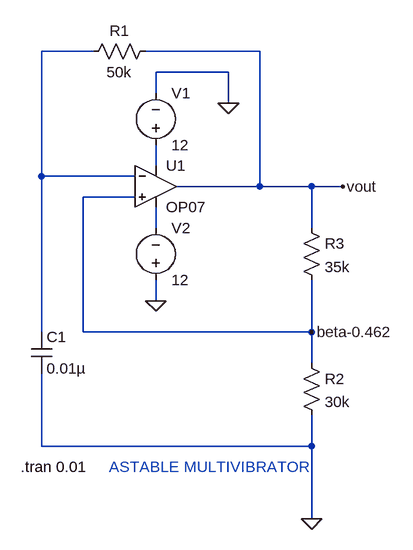
[diagram p0: schematic Astable Multivibrator.asc]
Astable Multivibrator.asc, the LTspice schematic file:
Version 4
SHEET 1 880 728
WIRE 80 -64 0 -64
WIRE 336 -64 160 -64
WIRE 288 -32 176 -32
WIRE 176 0 176 -32
WIRE 288 16 288 -32
WIRE 176 112 176 80
WIRE 0 128 0 -64
WIRE 144 128 0 128
WIRE 336 144 336 -64
WIRE 336 144 208 144
WIRE 416 144 336 144
WIRE 464 144 416 144
WIRE 144 160 64 160
WIRE 176 208 176 176
WIRE 416 208 416 144
WIRE 176 320 176 288
WIRE 0 368 0 128
WIRE 64 368 64 160
WIRE 416 368 416 288
WIRE 416 368 64 368
WIRE 416 416 416 368
WIRE 0 544 0 432
WIRE 416 544 416 496
WIRE 416 544 0 544
WIRE 416 656 416 544
FLAG 176 320 0
FLAG 288 16 0
FLAG 416 656 0
FLAG 464 144 vout
FLAG 416 368 beta-0.462
SYMBOL OpAmps\\OP07 176 80 R0
SYMATTR InstName U1
SYMBOL voltage 176 96 M180
WINDOW 0 24 96 Left 2
WINDOW 3 24 16 Left 2
WINDOW 123 0 0 Left 0
WINDOW 39 0 0 Left 0
SYMATTR InstName V1
SYMATTR Value 12
SYMBOL voltage 176 304 M180
WINDOW 0 24 96 Left 2
WINDOW 3 24 16 Left 2
WINDOW 123 0 0 Left 0
WINDOW 39 0 0 Left 0
SYMATTR InstName V2
SYMATTR Value 12
SYMBOL res 176 -80 R90
WINDOW 0 0 56 VBottom 2
WINDOW 3 32 56 VTop 2
SYMATTR InstName R1
SYMATTR Value 50k
SYMBOL cap -16 368 R0
SYMATTR InstName C1
SYMATTR Value 0.01µ
SYMBOL res 400 400 R0
SYMATTR InstName R2
SYMATTR Value 30k
SYMBOL res 400 192 R0
SYMATTR InstName R3
SYMATTR Value 35k
TEXT -32 576 Left 2 !.tran 0.01
TEXT 104 576 Left 2 ;ASTABLE MULTIVIBRATOR

The netlist it stands for:
* Astable Multivibrator.asc
XU1 beta-0.462 N001 N002 N003 vout LT1001  ; OP07, pins In+ In- V+ V- OUT
V1 N002 0 12
V2 0 N003 12
R1 vout N001 50k
C1 N001 0 0.01µ
R2 beta-0.462 0 30k
R3 vout beta-0.462 35k
.tran 0.01
* ASTABLE MULTIVIBRATOR
.lib LTC.lib
.backanno
.end